# EAGLE schematic micromod (EAGLE 7.3.0)
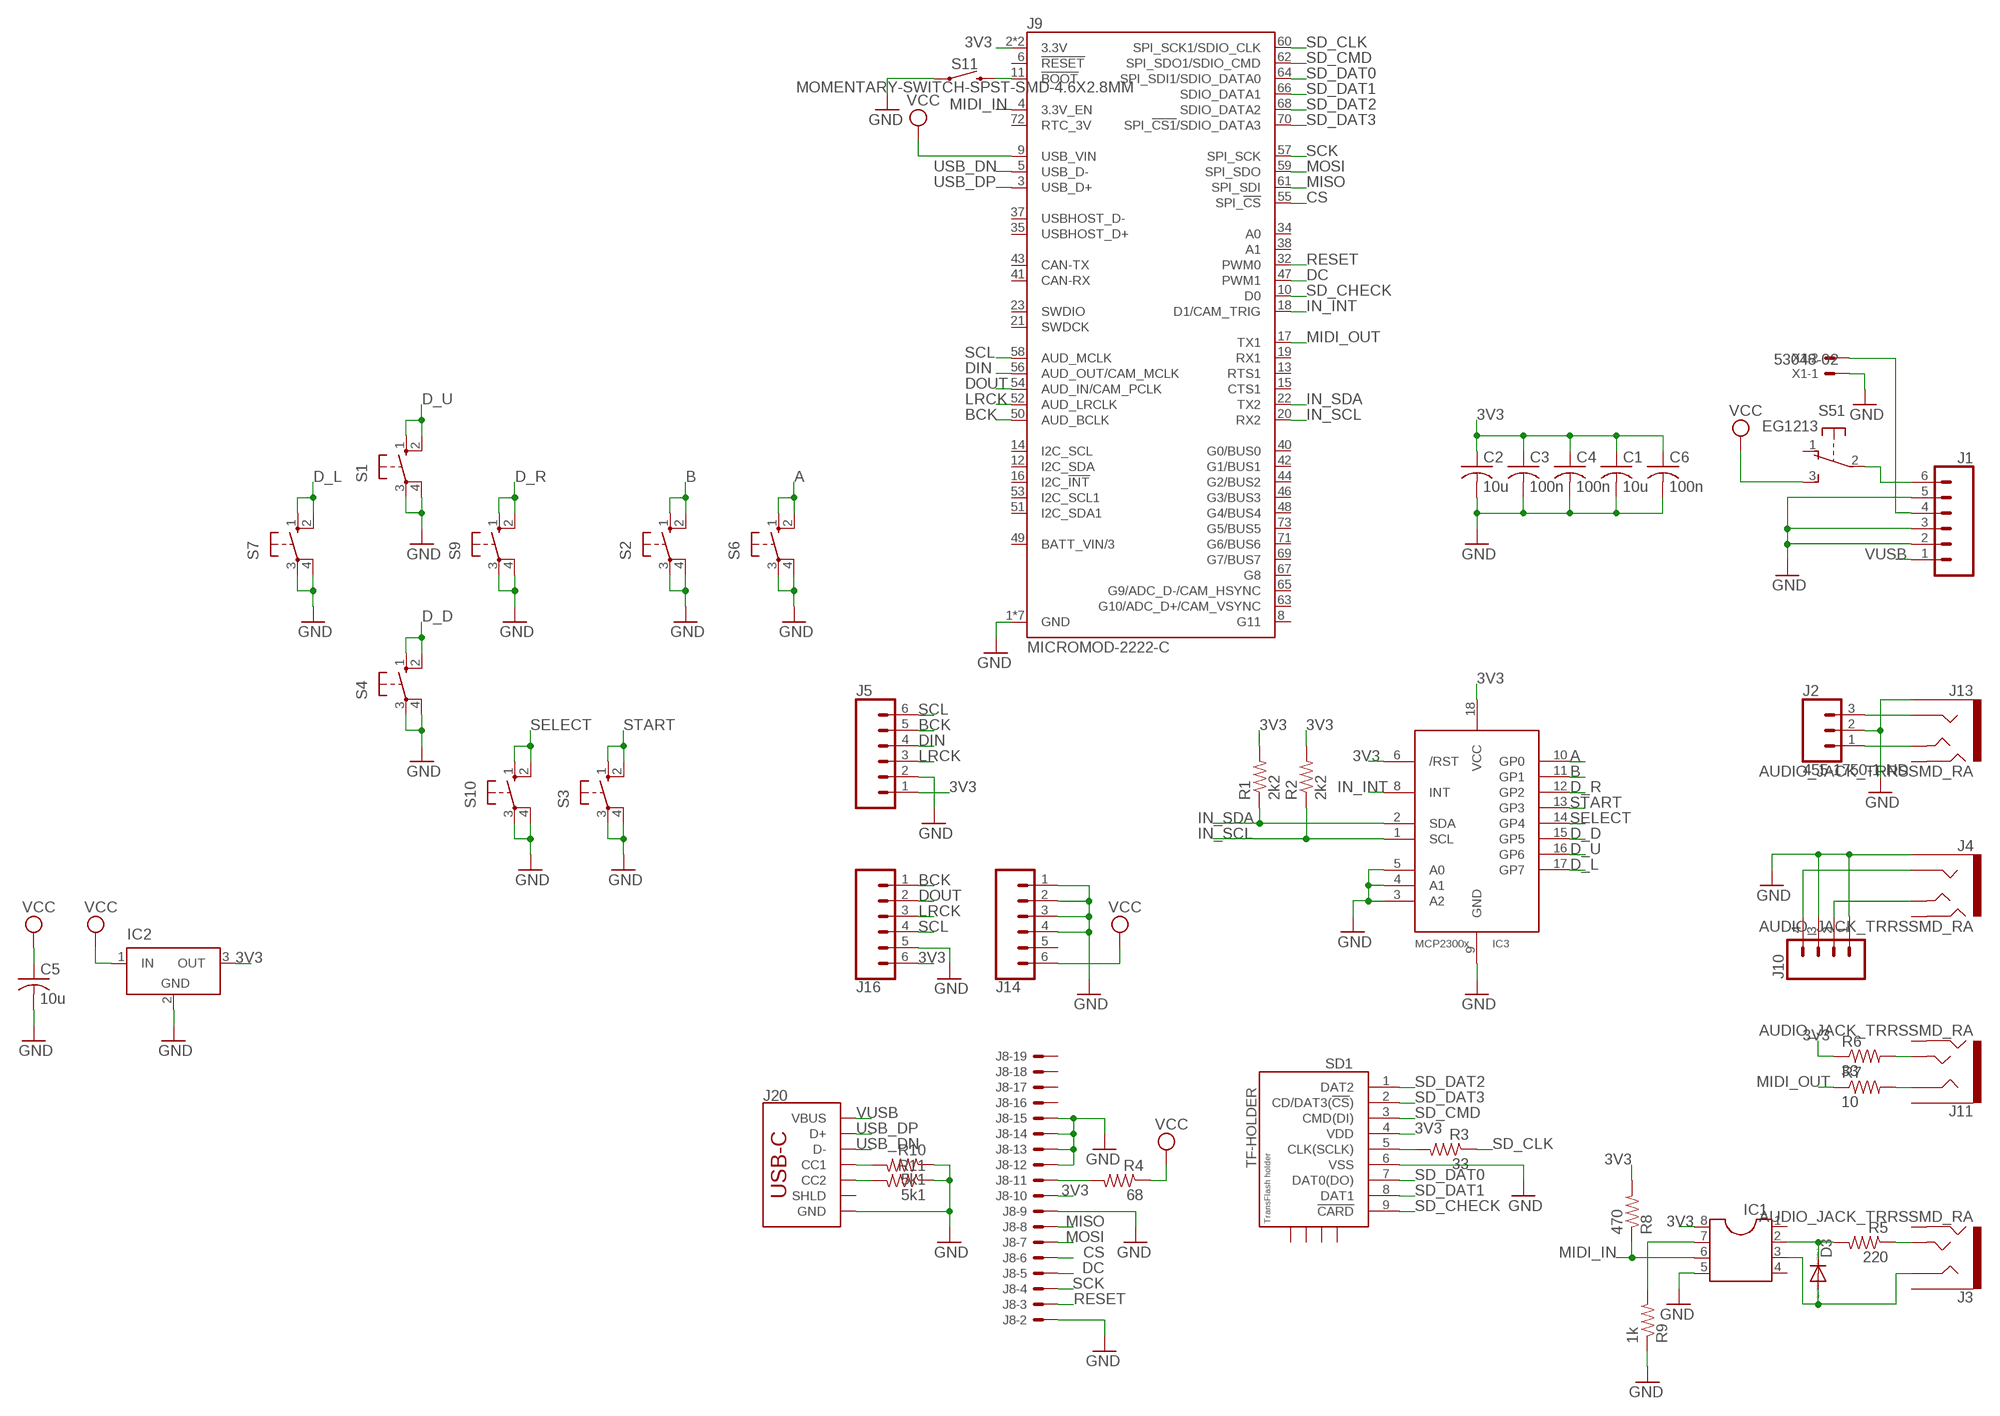
[diagram p0: schematic, sheet 1]

## Parts
C1  10u  C-USC0805  [C0805]
C2  10u  C-USC0805  [C0805]
C3  100n  C-USC0805  [C0805]
C4  100n  C-USC0805  [C0805]
C5  10u  C-USC0805  [C0805]
C6  100n  C-USC0805  [C0805]
D3  DIODE-MINIMELF  [MINIMELF]
IC1  DIL8  [DIL08]
IC2  LT1129CST5  [SOT223]
IC3  MCP23008/SO  [SO18W]
J1  CONN_06SILK_FEMALE_PTH  [1X06]
J2  455-1750-1-ND  CONN_03  [1X03]
J3  AUDIO_JACK_TRRSSMD_RA  [AUDIO_JACK_3.5MM_TRRS_SMD_RA]
J4  AUDIO_JACK_TRRSSMD_RA  [AUDIO_JACK_3.5MM_TRRS_SMD_RA]
J5  CONN_06SILK_FEMALE_PTH  [1X06]
J8  XF2E-2015-1  [XF2E-2015-1]
J9  MICROMOD-2222-C  [M.2-CONNECTOR-E]
J10  CONN_04  [1X04]
J11  AUDIO_JACK_TRRSSMD_RA  [AUDIO_JACK_3.5MM_TRRS_SMD_RA]
J13  AUDIO_JACK_TRRSSMD_RA  [AUDIO_JACK_3.5MM_TRRS_SMD_RA]
J14  CONN_06SILK_FEMALE_PTH  [1X06]
J16  CONN_06SILK_FEMALE_PTH  [1X06]
J20  USB_C_2-LAYER_PADS  [USB-C-16P-2LAYER-PADS]
R1  2k2  R-US_R0805  [R0805]
R2  2k2  R-US_R0805  [R0805]
R3  33  R-US_R0805  [R0805]
R4  68  R-US_R0805  [R0805]
R5  220  R-US_R0805  [R0805]
R6  33  R-US_R0805  [R0805]
R7  10  R-US_R0805  [R0805]
R8  470  R-US_R0805  [R0805]
R9  1k  R-US_R0805  [R0805]
R10  5k1  R-US_R0805  [R0805]
R11  5k1  R-US_R0805  [R0805]
S1  10-XX  [B3F-10XX]
S2  10-XX  [B3F-10XX]
S3  10-XX  [B3F-10XX]
S4  10-XX  [B3F-10XX]
S5  EG1213  [EG1213]
S6  10-XX  [B3F-10XX]
S7  10-XX  [B3F-10XX]
S9  10-XX  [B3F-10XX]
S10  10-XX  [B3F-10XX]
S11  MOMENTARY-SWITCH-SPST-SMD-4.6X2.8MM  [TACTILE_SWITCH_SMD_4.6X2.8MM]
SD1  TF-HOLDER  [TF-PULL]
X1  53048-02  [53048-02]

## Nets
3V3: C1.1 C2.1 C3.1 C4.1 C6.1 IC1.8 IC2.3(OUT) IC3.6(/RST) IC3.18(VCC) J5.1 J8.10 J9.2(3.3V) J9.74(3.3V) J16.6 R1.2 R2.2 R6.1 R8.2 SD1.4(VDD)
A: IC3.10(GP0) S6.1(S) S6.2(S1)
B: IC3.11(GP1) S2.1(S) S2.2(S1)
BCK: J5.5 J9.50(AUD_BCLK) J16.1
CS: J8.6 J9.55(SPI_!CS!)
D_D: IC3.15(GP5) S4.1(S) S4.2(S1)
D_L: IC3.17(GP7) S7.1(S) S7.2(S1)
D_R: IC3.12(GP2) S9.1(S) S9.2(S1)
D_U: IC3.16(GP6) S1.1(S) S1.2(S1)
DC: J8.5 J9.47(PWM1)
DIN: J5.4 J9.56(AUD_OUT/CAM_MCLK)
DOUT: J9.54(AUD_IN/CAM_PCLK) J16.2
GND: C1.2 C2.2 C3.2 C4.2 C5.2 C6.2 IC1.5 IC2.2(GND) IC3.3(A2) IC3.4(A1) IC3.5(A0) IC3.9(GND) J1.2 J1.3 J1.5 J2.2 J4.EARTH J5.2 J8.2 J8.9 J8.12 J8.13 J8.14 J8.15 J9.1(GND) J9.7(GND) J9.33(GND) J9.36(GND) J9.39(GND) J9.45(GND) J9.75(GND) J10.1 J10.3 J13.EARTH J14.1 J14.2 J14.3 J14.4 J16.5 J20.GND J20.GND2(GND) R9.1 R10.1 R11.1 S1.3(P) S1.4(P1) S2.3(P) S2.4(P1) S3.3(P) S3.4(P1) S4.3(P) S4.4(P1) S6.3(P) S6.4(P1) S7.3(P) S7.4(P1) S9.3(P) S9.4(P1) S10.3(P) S10.4(P1) S11.1 S11.2 SD1.6(VSS) X1.1
IN_INT: IC3.8(INT) J9.18(D1/CAM_TRIG)
IN_SCL: IC3.1(SCL) J9.20(RX2) R2.1
IN_SDA: IC3.2(SDA) J9.22(TX2) R1.1
LRCK: J5.3 J9.52(AUD_LRCLK) J16.3
MIDI_IN: IC1.6 J9.4(3.3V_EN) R8.1
MIDI_OUT: J9.17(TX1) R7.1
MISO: J8.8 J9.61(SPI_SDI)
MOSI: J8.7 J9.59(SPI_SDO)
N$1: J8.11 R4.2
N$2: J2.3 J13.RING1
N$3: J2.1 J13.TIP
N$4: J4.RING1 J10.4
N$5: J4.TIP J10.2
N$6: J1.4 X1.2
N$7: R3.2 SD1.5(CLK(SCLK))
N$8: J20.A5(CC1) R10.2
N$9: J20.B5(CC2) R11.2
N$10: J9.11(!BOOT!) S11.3 S11.4
N$11: J3.TIP R5.1
N$12: J11.TIP R6.2
N$13: J11.RING1 R7.2
N$18: D3.C IC1.2 R5.2
N$19: D3.A IC1.3 J3.RING1
N$22: IC1.7 R9.2
N$24: J1.6 S5.2(1:P)
RESET: J8.3 J9.32(PWM0)
SCK: J8.4 J9.57(SPI_SCK)
SCL: J5.6 J9.58(AUD_MCLK) J16.4
SD_CHECK: J9.10(D0) SD1.9(!CARD)
SD_CLK: J9.60(SPI_SCK1/SDIO_CLK) R3.1
SD_CMD: J9.62(SPI_SDO1/SDIO_CMD) SD1.3(CMD(DI))
SD_DAT0: J9.64(SPI_SDI1/SDIO_DATA0) SD1.7(DAT0(DO))
SD_DAT1: J9.66(SDIO_DATA1) SD1.8(DAT1)
SD_DAT2: J9.68(SDIO_DATA2) SD1.1(DAT2)
SD_DAT3: J9.70(SPI_!CS1!/SDIO_DATA3) SD1.2(CD/DAT3(!CS!))
SELECT: IC3.14(GP4) S10.1(S) S10.2(S1)
START: IC3.13(GP3) S3.1(S) S3.2(S1)
USB_DN: J9.5(USB_D-) J20.A7(D-) J20.B7(D-)
USB_DP: J9.3(USB_D+) J20.A6(D+) J20.B6(D+)
VCC: C5.1 IC2.1(IN) J9.9(USB_VIN) J14.6 R4.1 S5.3(1:S)
VUSB: J1.1 J20.VBUS1(VBUS) J20.VBUS2(VBUS)
Unconnected: IC1.1 IC1.4 J3.EARTH J3.RING2 J4.RING2 J8.16 J8.17 J8.18 J8.19 J9.6(!RESET!) J9.8(G11) J9.12(I2C_SDA) J9.13(RTS1) J9.14(I2C_SCL) J9.15(CTS1) J9.16(I2C_!INT!) J9.19(RX1) J9.21(SWDCK) J9.23(SWDIO) J9.34(A0) J9.35(USBHOST_D+) J9.37(USBHOST_D-) J9.38(A1) J9.40(G0/BUS0) J9.41(CAN-RX) J9.42(G1/BUS1) J9.43(CAN-TX) J9.44(G2/BUS2) J9.46(G3/BUS3) J9.48(G4/BUS4) J9.49(BATT_VIN/3) J9.51(I2C_SDA1) J9.53(I2C_SCL1) J9.63(G10/ADC_D+/CAM_VSYNC) J9.65(G9/ADC_D-/CAM_HSYNC) J9.67(G8) J9.69(G7/BUS7) J9.71(G6/BUS6) J9.72(RTC_3V) J9.73(G5/BUS5) J11.EARTH J11.RING2 J13.RING2 J14.5 J20.SHLD1(SHLD) J20.SHLD2(SHLD) J20.SHLD3(SHLD) J20.SHLD4(SHLD) S5.1(1:O) S5.MT1(MT) S5.MT2(MT) SD1.S1 SD1.S2 SD1.S3 SD1.S4

## Power pins joined to a net without a drawn wire
GND: IC2.4(GND)

## Library data of the parts
C1-C6 = rcl:C-US: CAPACITOR, American symbol
D3 = diode:DIODE-: DIODE
IC1 = ic-package:DIL8: Dual In Line / Socket
IC2 = linear-technology:LT1129CST5: VOLTAGE REGULATOR with shutdown; MPN: LT1129CST-5#PBF; OC_FARNELL: 1663375; OC_NEWARK: 57M2069
IC3 = adafruit:MCP23008: MCP23008 Inexpensive i2c i/o expander - 8 general purpose i/o pins with optional pullups
J1 J5 J14 J16 = lbr_SparkFun-Eagle-Libraries_SparkFun-Connectors:CONN_06: Multi connection point. Often used as Generic Header-pin footprint for 0.1 inch spaced/style header connections On any of the 0.1 inch spaced packages, you can populate with these: Break Away Headers - Straight <https://www.sparkfun.com/products/116> (PRT-00116) Break Away Male Headers - Right Angle <https://www.sparkfun.com/products/553> (PRT-00553) Female Headers <https://www.sparkfun.com/products/115> (PRT-00115) Break Away Headers - Machine Pin <https://www.sparkfun.com/products/117> (PRT-00117) Break Away Female Headers - Swiss Machine Pin <https://www.sparkfun.com/products/743> (PRT-00743) Arduino Stackable Header - 6 Pin <https://www.sparkfun.com/products/9280> (PRT-09280) For SCREWTERMINALS and SPRING TERMINALS visit here: Screw Terimnals on SparkFun.com <https://www.sparkfun.com/search/results?term=Screw+Terminals> (5mm/3.5mm/2.54mm spacing) This device is also useful as a general connection point to wire up your design to another part of your project. Our various solder wires solder well into these plated through hole pads. Hook-Up Wire - Assortment (Stranded, 22 AWG) <https://www.sparkfun.com/products/11375> (PRT-11375) Hook-Up Wire - Assortment (Solid Core, 22 AWG) <https://www.sparkfun.com/products/11367> (PRT-11367) View the entire wire category on our website here <https://www.sparkfun.com/categories/141>; PROD_ID: CONN-08437
J2 = lbr_SparkFun-Eagle-Libraries_SparkFun-Connectors:CONN_03: Multi connection point. Often used as Generic Header-pin footprint for 0.1 inch spaced/style header connections On any of the 0.1 inch spaced packages, you can populate with these: Break Away Headers - Straight <https://www.sparkfun.com/products/116> (PRT-00116) Break Away Male Headers - Right Angle <https://www.sparkfun.com/products/553> (PRT-00553) Female Headers <https://www.sparkfun.com/products/115> (PRT-00115) Break Away Headers - Machine Pin <https://www.sparkfun.com/products/117> (PRT-00117) Break Away Female Headers - Swiss Machine Pin <https://www.sparkfun.com/products/743> (PRT-00743) Stackable Header - 3 Pin (Female, 0.1") <https://www.sparkfun.com/products/13875> (PRT-13875) For SCREWTERMINALS and SPRING TERMINALS visit here: Screw Terimnals on SparkFun.com <https://www.sparkfun.com/search/results?term=Screw+Terminals> (5mm/3.5mm/2.54mm spacing) This device is also useful as a general connection point to wire up your design to another part of your project. Our various solder wires solder well into these plated through hole pads. Hook-Up Wire - Assortment (Stranded, 22 AWG) <https://www.sparkfun.com/products/11375> (PRT-11375) Hook-Up Wire - Assortment (Solid Core, 22 AWG) <https://www.sparkfun.com/products/11367> (PRT-11367) View the entire wire category on our website here <https://www.sparkfun.com/categories/141> Special notes: Molex polarized connector foot print use with SKU : PRT-08232 with associated crimp pins and housings.; PROD_ID: XXX-00000
J3 J4 J11 J13 = lbr_SparkFun-Eagle-Libraries_SparkFun-Connectors:AUDIO_JACK_TRRS: Audio Jack - 3.5mm TRRS (SMD) This is a 3.5mm TRRS SMD audio jack. TRRS connectors are the audio-style connectors that you see on some phones, MP3 players and development boards. TRRS stands for “tip, ring, ring, sleeve,” which reflects that this has three conductors and a ground. SparkFun Products: Audio Jack <https://www.sparkfun.com/products/12639> mbed Starter Kit <https://www.sparkfun.com/products/12968> SparkFun TRRS 3.5mm Jack Breakout <https://www.sparkfun.com/products/11570>; PROD_ID: CONN-10676; SF_ID: PRT-12639
J8 = con-omron-kopia:XF2*-20?: OMRON FPC Connector Source : http://www.omron.com/ecb/products/pdf/fpc.pdf; MPN: XF2E-2015-1; OC_FARNELL: unknown; OC_NEWARK: 37M9453
J9 = SparkFun-MicroMod:MICROMOD: MicroMod Connector Description: A card edge connector and mating PCB connector to allow various MicroMod Processor Boards to be coupled with various carrier boards of different capabilities. Based on the M.2 standard.; PROD_ID: CONN-14877
J10 = lbr_SparkFun-Eagle-Libraries_SparkFun-Connectors:CONN_04: Multi connection point. Often used as Generic Header-pin footprint for 0.1 inch spaced/style header connections On any of the 0.1 inch spaced packages, you can populate with these: Break Away Headers - Straight <https://www.sparkfun.com/products/116> (PRT-00116) Break Away Male Headers - Right Angle <https://www.sparkfun.com/products/553> (PRT-00553) Female Headers <https://www.sparkfun.com/products/115> (PRT-00115) Break Away Headers - Machine Pin <https://www.sparkfun.com/products/117> (PRT-00117) Break Away Female Headers - Swiss Machine Pin <https://www.sparkfun.com/products/743> (PRT-00743) For SCREWTERMINALS and SPRING TERMINALS visit here: Screw Terimnals on SparkFun.com <https://www.sparkfun.com/search/results?term=Screw+Terminals> (5mm/3.5mm/2.54mm spacing) This device is also useful as a general connection point to wire up your design to another part of your project. Our various solder wires solder well into these plated through hole pads. Hook-Up Wire - Assortment (Stranded, 22 AWG) <https://www.sparkfun.com/products/11375> (PRT-11375) Hook-Up Wire - Assortment (Solid Core, 22 AWG) <https://www.sparkfun.com/products/11367> (PRT-11367) View the entire wire category on our website here <https://www.sparkfun.com/categories/141> Special notes: Molex polarized connector foot print use with SKU : PRT-08231 with associated crimp pins and housings. 1MM SMD Version SKU: PRT-10208; PROD_ID: CONN-09696
J20 = SparkFun-Connectors:USB_C: USB Type C 16Pin Connector Super Speed pins not available on the 16-pin purely SMD connector so this part is best for USB 2.0 implementations. D1 and D2 are tied together enabling D+/- no matter which way the cable is plugged into the connector. The two channel configuration pins (CC1/2) are exposed. These are normally connected to ground via 5.1k resistors but can be reconfigured for high current/high power applications. **4-LAYER BOARD WARNING!!** If designing 4-layer board, make sure to select the variant _4-LAYER-ISOLATED. The linked footprint (USB-C-16-4LAYER-ISOLATED) includes some very necessary cutout polygons in the inner layers (2 and 15). This prevents the PTH mounting shield legs on the USB connector from electrically connecting any other polygons on the inner layers (usually VCC and GND).; PROD_ID: CONN-14122
R1-R11 = rcl:R-US_: RESISTOR, American symbol
S1-S4 S6 S7 S9 S10 = switch-omron:10-XX: OMRON SWITCH; MPN: B3F-1000; OC_FARNELL: 176432; OC_NEWARK: 36M3542
S5 = adafruit:EG1213: E-Switch right-angle slide SPDT Part #EG1213 http://www.ladyada.net/library/eagle
S11 = SparkFun-Switches:MOMENTARY-SWITCH-SPST: Momentary Switch (Pushbutton) - SPST Normally-open (NO) SPST momentary switches (buttons, pushbuttons). Variants PTH-12MM - 12mm square, through-hole Momentary Pushbutton Switch - 12mm Square <https://www.sparkfun.com/products/9190> (COM-09190) PTH-6.0MM, PTH-6.0MM-KIT - 6.0mm square, through-hole Mini Pushbutton Switch <https://www.sparkfun.com/products/97> (COM-00097) KIT package intended for soldering kit's - only one side of pads' copper is exposed. PTH-RIGHT-ANGLE-KIT - Right-angle, through-hole Right Angle Tactile Button <https://www.sparkfun.com/products/10791> - Used on SparkFun BigTime Watch Kit <https://www.sparkfun.com/products/11734> SMD-12MM - 12mm square, surface-mount Tactile Button - SMD (12mm) <https://www.sparkfun.com/products/12993> (COM-12993) Used on SparkFun PicoBoard <https://www.sparkfun.com/products/11888> SMD-4.5MM - 4.5mm Square Trackball Switch Used on SparkFun Blackberry Trackballer Breakout <https://www.sparkfun.com/products/13169> SMD-4.6MMX2.8MM - 4.60mm x 2.80mm, surface mount Used on SparkFun Pro Micro - RP2040 <https://www.sparkfun.com/products/17717> SMD-5.2MM, SMD-5.2-REDUNDANT - 5.2mm square, surface-mount Mini Pushbutton Switch - SMD <https://www.sparkfun.com/products/8720> (COM-08720) Used on Arduino Pro Mini <https://www.sparkfun.com/products/11114> REDUNDANT package connects both switch circuits together SMD-6.0X3.5MM - 6.0 x 3.5mm, surface mount Momentary Reset Switch SMD <https://www.sparkfun.com/products/8229> (COM-08229) SMD-6.2MM-TALL - 6.2mm square, surface mount Tactile Button - SMD (6mm) <https://www.sparkfun.com/products/12992> Used on SparkFun Digital Sandbox <https://www.sparkfun.com/products/12651> SMD-RIGHT-ANGLE - Right-angle, surface mount Used on SparkFun Block for Intel® Edison - Arduino <https://www.sparkfun.com/products/13036>; PROD_ID: SWCH-15606
SD1 = sd-mmc:TF-HOLDER: TF / Micro SD socket is PUSH-PUSH type, the card can be pushed into and auto locked and pushed out by simply press the card. Surface Mounting type.
X1 = con-molex:53?-02: CONNECTOR wire to board 1.25 mm (.049 inch) pitch header; MF: MOLEX; MPN: 53048-0210; OC_FARNELL: 1012259; OC_NEWARK: 57H4718